# Altium project Xbee_Explorer_Coordinator.PrjPcb
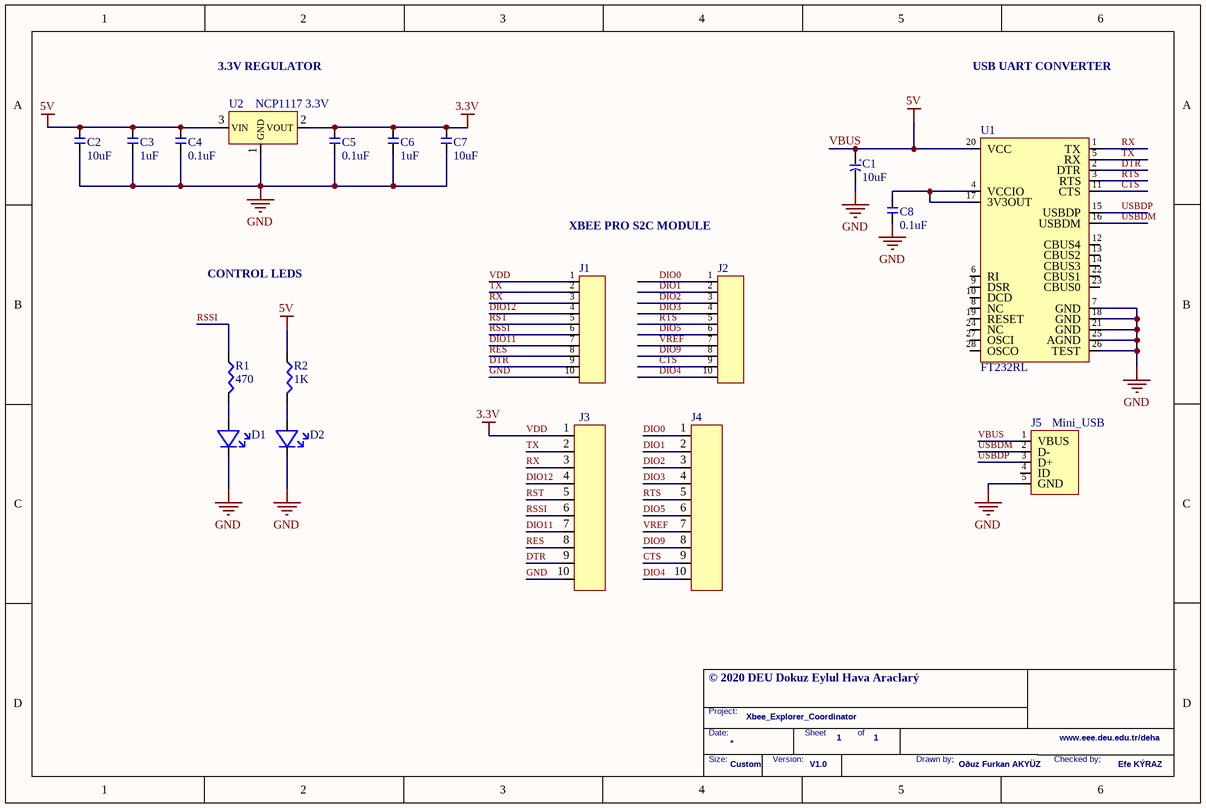
[diagram p0: Xbee_Coordinator.SchDoc]
Version: V1.0; Size: Custom; Project_Name: Xbee_Explorer_Coordinator; Drawn_By: Oðuz Furkan AKYÜZ; Company_: © 2020 DEU Dokuz Eylul Hava Araclarý; Checked_By: Efe KÝRAZ
1 sheet, 20 parts. Net scope: global (net labels, ports and power ports of the same name join across sheets).
Board file: PCB1.PcbDoc

## Sheet Xbee_Coordinator.SchDoc: Xbee Coordinator Explorer
size 224 x 149 mm; DocumentNumber: 1; Revision: V1.0; SheetNumber: 1; SheetTotal: 1

### Parts
*  TitleBlock  (value not drawn)  (graphical)
C1  10uF  [5x11 Radial Capacitor]
C2  10uF  [C_1206]
C3  1uF  [C_1206]
C4  0.1uF  [C_1206]
C5  0.1uF  [C_1206]
C6  1uF  [C_1206]
C7  10uF  [C_1206]
C8  0.1uF  [C_1206]
D1  LED_0805  [LED_0805]  (value not drawn)
D2  LED_0805  [LED_0805]  (value not drawn)
J1  Header_1x10_2mm  [Header 1x10 2mm]  (value not drawn)
J2  Header_1x10_2mm  [Header 1x10 2mm]  (value not drawn)
J3  Pin_Header_1x10Pos_2.54mm  [PinHeader_1x10Pin_2.54mm]  (value not drawn)
J4  Pin_Header_1x10Pos_2.54mm  [PinHeader_1x10Pin_2.54mm]  (value not drawn)
J5  Mini_USB  [Mini_USB]
R1  470  [R_1206]
R2  1K  [R_1206]
U1  FT232RL  [SSOP-28Pin]
U2  NCP1117 3.3V  [NCP1117 3.3V]

### Nets
GND: C1.2 C2.1 C3.1 C4.1 C5.1 C6.1 C7.1 C8.1 D1.2 D2.2 J1.10 J3.10 J5.5(GND) U1.7(GND) U1.18(GND) U1.21(GND) U1.25(AGND) U1.26(TEST) U2.1(GND)
VBUS: C1.1 C2.2 C3.2 C4.2 J5.1(VBUS) R2.1 U1.20(VCC) U2.3(VIN)  [also labelled 5V]
VDD: C5.2 C6.2 C7.2 J1.1 J3.1 U2.2(VOUT)  [also labelled 3.3V]
CTS: J2.9 J4.9 U1.11(CTS)
DIO0: J2.1 J4.1
DIO1: J2.2 J4.2
DIO2: J2.3 J4.3
DIO3: J2.4 J4.4
DIO4: J2.10 J4.10
DIO5: J2.6 J4.6
DIO9: J2.8 J4.8
DIO11: J1.7 J3.7
DIO12: J1.4 J3.4
DTR: J1.9 J3.9 U1.2(DTR)
RES: J1.8 J3.8
RSSI: J1.6 J3.6 R1.1
RST: J1.5 J3.5
RTS: J2.5 J4.5 U1.3(RTS)
RX: J1.3 J3.3 U1.1(TX)
TX: J1.2 J3.2 U1.5(RX)
USBDM: J5.2(D-) U1.16(USBDM)
USBDP: J5.3(D+) U1.15(USBDP)
VREF: J2.7 J4.7
NetC8_2: C8.2 U1.4(VCCIO) U1.17(3V3OUT)
NetD1_1: D1.1 R1.2
NetD2_1: D2.1 R2.2

Not connected (* = marked no-connect by the designer): J5 4(ID); U1 6(RI) 8(NC) 9(DSR) 10(DCD) 12(CBUS4) 13(CBUS2) 14(CBUS3) 19(RESET) 22(CBUS1) 23(CBUS0) 24(NC) 27(OSCI) 28(OSCO)

### Notes on the sheet
- 3.3V REGULATOR
- USB UART CONVERTER
- CONTROL LEDS
- XBEE PRO S2C MODULE
- (in symbol Cap_Pol_5x11) +
- (in symbol TitleBlock) Project:; Date:; Sheet; of; www.eee.deu.edu.tr/deha; Size:; Version:; Drawn by;; Checked by;

### Library data of the parts
C1 = Cap_Pol_5x11: 5x11 Radial Polarized Capacitor
C2-C8 = C_1206(3216): 1206(3216) package capacitor
R1 R2 = R_1206(3216): 1206(3216) package resistor
U1 = FT232RL: FT232RL_USB-Converter
U2 = NCP1117 3.3V: NCP1117-3.3V Linear Regulator